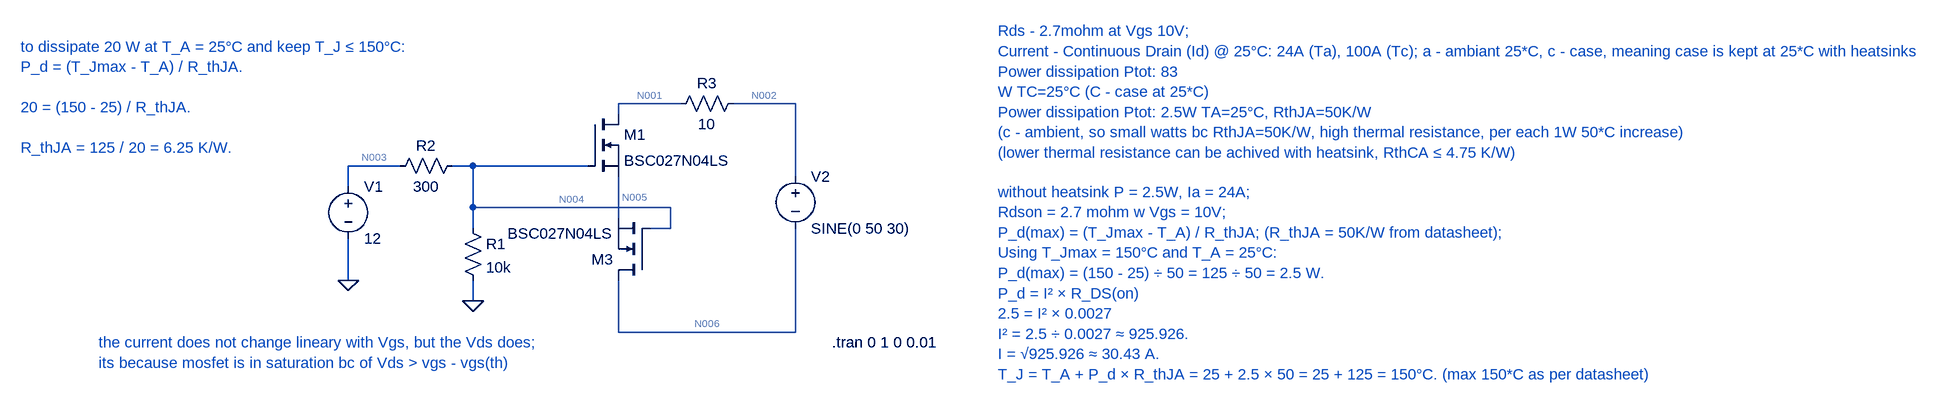
[diagram p0: schematic nmosfet_back_to_back_common_source.asc]
nmosfet_back_to_back_common_source.asc, the LTspice schematic file:
Version 4
SHEET 1 2316 680
WIRE 208 96 112 96
WIRE 384 96 288 96
WIRE 112 112 112 96
WIRE -224 192 -304 192
WIRE -112 192 -144 192
WIRE 64 192 -112 192
WIRE 384 208 384 96
WIRE -304 224 -304 192
WIRE -112 256 -112 192
WIRE 192 256 -112 256
WIRE 112 272 112 208
WIRE -112 288 -112 256
WIRE 192 288 192 256
WIRE 192 288 160 288
WIRE -304 368 -304 304
WIRE -112 400 -112 368
WIRE 112 448 112 368
WIRE 384 448 384 288
WIRE 384 448 112 448
FLAG -112 400 0
FLAG -304 368 0
SYMBOL nmos 64 112 R0
SYMATTR InstName M1
SYMATTR Value BSC027N04LS
SYMBOL nmos 160 368 R180
SYMATTR InstName M3
SYMATTR Value BSC027N04LS
SYMBOL res -128 272 R0
SYMATTR InstName R1
SYMATTR Value 10k
SYMBOL res -128 176 R90
WINDOW 0 0 56 VBottom 2
WINDOW 3 32 56 VTop 2
SYMATTR InstName R2
SYMATTR Value 300
SYMBOL voltage -304 208 R0
WINDOW 123 0 0 Left 0
WINDOW 39 0 0 Left 0
SYMATTR InstName V1
SYMATTR Value 12
SYMBOL voltage 384 192 R0
WINDOW 123 0 0 Left 0
WINDOW 39 0 0 Left 0
SYMATTR InstName V2
SYMATTR Value SINE(0 50 30)
SYMBOL res 304 80 R90
WINDOW 0 0 56 VBottom 2
WINDOW 3 32 56 VTop 2
SYMATTR InstName R3
SYMATTR Value 10
TEXT 440 464 Left 2 !.tran 0 1 0 0.01
TEXT 696 -16 Left 2 ;Rds - 2.7mohm at Vgs 10V;\nCurrent - Continuous Drain (Id) @ 25°C: 24A (Ta), 100A (Tc); a - ambiant 25*C, c - case, meaning case is kept at 25*C with heatsinks\nPower dissipation Ptot: 83\nW TC=25°C (C - case at 25*C)\nPower dissipation Ptot: 2.5W TA=25°C, RthJA=50K/W\n(c - ambient, so small watts bc RthJA=50K/W, high thermal resistance, per each 1W 50*C increase)\n(lower thermal resistance can be achived with heatsink, RthCA ≤ 4.75 K/W)
TEXT -808 8 Left 2 ;to dissipate 20 W at T_A = 25°C and keep T_J ≤ 150°C:\nP_d = (T_Jmax - T_A) / R_thJA.\n \n20 = (150 - 25) / R_thJA.\n \nR_thJA = 125 / 20 = 6.25 K/W.
TEXT 696 232 Left 2 ;without heatsink P = 2.5W, Ia = 24A;\nRdson = 2.7 mohm w Vgs = 10V;\nP_d(max) = (T_Jmax - T_A) / R_thJA; (R_thJA = 50K/W from datasheet);\nUsing T_Jmax = 150°C and T_A = 25°C:\nP_d(max) = (150 - 25) ÷ 50 = 125 ÷ 50 = 2.5 W.\nP_d = I² × R_DS(on)\n2.5 = I² × 0.0027\nI² = 2.5 ÷ 0.0027 ≈ 925.926.\nI = √925.926 ≈ 30.43 A.\nT_J = T_A + P_d × R_thJA = 25 + 2.5 × 50 = 25 + 125 = 150°C. (max 150*C as per datasheet)
TEXT -688 464 Left 2 ;the current does not change lineary with Vgs, but the Vds does;\nits because mosfet is in saturation bc of Vds > vgs - vgs(th)

The netlist it stands for:
* nmosfet_back_to_back_common_source.asc
M1 N001 N004 N005 N005 BSC027N04LS
M3 N006 N004 N005 N005 BSC027N04LS
R1 N004 0 10k
R2 N004 N003 300
V1 N003 0 12
V2 N002 N006 SINE(0 50 30)
R3 N002 N001 10
.model NMOS NMOS
.model PMOS PMOS
.lib standard.mos
.tran 0 1 0 0.01
* Rds - 2.7mohm at Vgs 10V;
* Current - Continuous Drain (Id) @ 25°C: 24A (Ta), 100A (Tc); a - ambiant 25*C, c - case, meaning case is kept at 25*C with heatsinks
* Power dissipation Ptot: 83
* W TC=25°C (C - case at 25*C)
* Power dissipation Ptot: 2.5W TA=25°C, RthJA=50K/W
* (c - ambient, so small watts bc RthJA=50K/W, high thermal resistance, per each 1W 50*C increase)
* (lower thermal resistance can be achived with heatsink, RthCA ≤ 4.75 K/W)
* to dissipate 20 W at T_A = 25°C and keep T_J ≤ 150°C:
* P_d = (T_Jmax - T_A) / R_thJA.
* 20 = (150 - 25) / R_thJA.
* R_thJA = 125 / 20 = 6.25 K/W.
* without heatsink P = 2.5W, Ia = 24A;
* Rdson = 2.7 mohm w Vgs = 10V;
* P_d(max) = (T_Jmax - T_A) / R_thJA; (R_thJA = 50K/W from datasheet);
* Using T_Jmax = 150°C and T_A = 25°C:
* P_d(max) = (150 - 25) ÷ 50 = 125 ÷ 50 = 2.5 W.
* P_d = I² × R_DS(on)
* 2.5 = I² × 0.0027
* I² = 2.5 ÷ 0.0027 ≈ 925.926.
* I = √925.926 ≈ 30.43 A.
* T_J = T_A + P_d × R_thJA = 25 + 2.5 × 50 = 25 + 125 = 150°C. (max 150*C as per datasheet)
* the current does not change lineary with Vgs, but the Vds does;
* its because mosfet is in saturation bc of Vds > vgs - vgs(th)
.backanno
.end

* Results of the author's LTspice run, read from the files saved beside the schematic
* Operating Point, zero values left out:
*   V(n004) = 11.65 V
*   V(n003) = 12 V
*   I(R1) = 1.165 mA
*   I(R2) = -1.165 mA
*   I(V1) = -1.165 mA
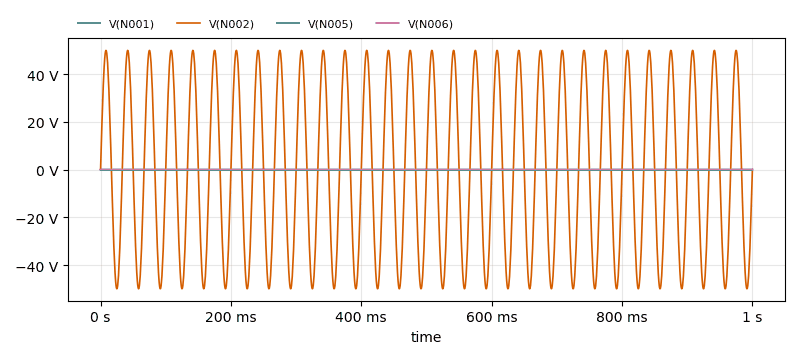
[diagram p1: Transient Analysis of nmosfet_back_to_back_common_source.asc, plotted from the saved traces]
* Transient Analysis, 1 run:
*   V(N001): min -10.13 mV, max 10.11 mV, average -11.58 µV, rms 7.111 mV, last 8.548 µV
*   V(N002): min -49.98 V, max 49.98 V, average 1.24 mV, rms 35.68 V, last 8.548 µV
*   V(N005): min -41.94 µV, max 15.18 µV, average -12.43 µV, rms 19.99 µV, last 8.548 µV
*   V(N006): min -10.16 mV, max 10.14 mV, average -12.54 µV, rms 7.243 mV, last 8.548 µV